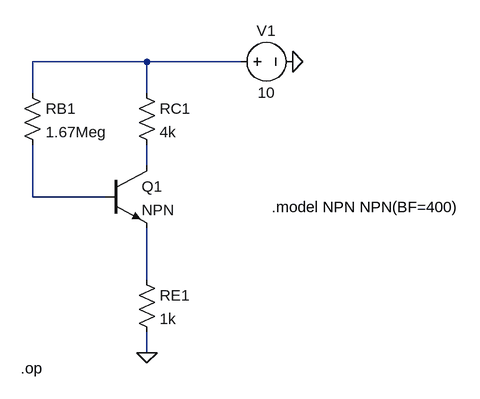
[diagram p0: schematic Lab6_1.asc]
Lab6_1.asc, the LTspice schematic file:
Version 4
SHEET 1 1476 680
WIRE 224 -16 48 -16
WIRE 368 -16 224 -16
WIRE 48 32 48 -16
WIRE 224 32 224 -16
WIRE 224 144 224 112
WIRE 48 192 48 112
WIRE 160 192 48 192
WIRE 224 320 224 240
WIRE 224 432 224 400
FLAG 224 432 0
FLAG 448 -16 0
SYMBOL res 32 16 R0
SYMATTR InstName RB1
SYMATTR Value 1.67Meg
SYMBOL res 208 16 R0
SYMATTR InstName RC1
SYMATTR Value 4k
SYMBOL res 208 304 R0
SYMATTR InstName RE1
SYMATTR Value 1k
SYMBOL voltage 352 -16 R270
WINDOW 0 32 56 VTop 2
WINDOW 3 -32 56 VBottom 2
WINDOW 123 0 0 Left 0
WINDOW 39 0 0 Left 0
SYMATTR InstName V1
SYMATTR Value 10
SYMBOL npn 160 144 R0
SYMATTR InstName Q1
TEXT 30 456 Left 2 !.op
TEXT 416 208 Left 2 !.model NPN NPN(BF=400)

The netlist it stands for:
* Lab6_1.asc
RB1 N001 N003 1.67Meg
RC1 N001 N002 4k
RE1 N004 0 1k
V1 N001 0 10
Q1 N002 N003 N004 0 NPN
.model NPN NPN
.model PNP PNP
.lib standard.bjt
.op
.model NPN NPN(BF=400)
.backanno
.end